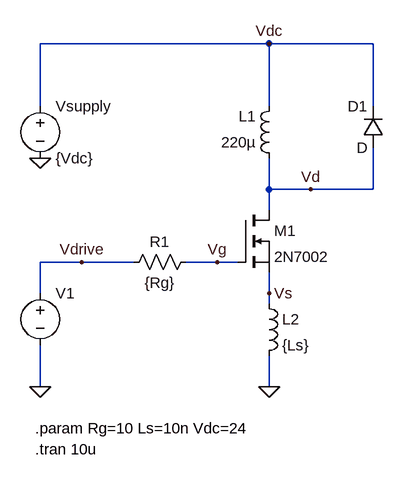
[diagram p0: schematic DoublePulseTest.asc]
DoublePulseTest.asc, the LTspice schematic file:
Version 4
SHEET 1 920 680
WIRE 432 -208 80 -208
WIRE 592 -208 432 -208
WIRE 80 -112 80 -208
WIRE 432 -112 432 -208
WIRE 592 -112 592 -208
WIRE 432 16 432 -32
WIRE 496 16 432 16
WIRE 592 16 592 -48
WIRE 592 16 496 16
WIRE 432 48 432 16
WIRE 144 128 80 128
WIRE 224 128 144 128
WIRE 352 128 304 128
WIRE 384 128 352 128
WIRE 80 176 80 128
WIRE 432 176 432 144
WIRE 432 192 432 176
WIRE 80 320 80 256
WIRE 432 320 432 272
FLAG 432 320 0
FLAG 80 320 0
FLAG 80 -32 0
FLAG 432 -208 Vdc
FLAG 352 128 Vg
FLAG 496 16 Vd
FLAG 432 176 Vs
FLAG 144 128 Vdrive
SYMBOL voltage 80 160 R0
WINDOW 3 24 96 Invisible 2
WINDOW 123 0 0 Left 0
WINDOW 39 0 0 Left 0
SYMATTR Value PWL(0 0 1u 0 1.001u 5 5.6u 5 5.6001u 0 7u 0 7.001u 5 8u 5 8.001u 0)
SYMATTR InstName V1
SYMBOL nmos 384 48 R0
SYMATTR InstName M1
SYMATTR Value 2N7002
SYMBOL diode 608 -48 R180
WINDOW 0 24 64 Left 2
WINDOW 3 24 0 Left 2
SYMATTR InstName D1
SYMBOL ind 448 -16 R180
WINDOW 0 36 80 Left 2
WINDOW 3 36 40 Left 2
SYMATTR InstName L1
SYMATTR Value 220µ
SYMBOL ind 416 176 R0
SYMATTR InstName L2
SYMATTR Value {Ls}
SYMBOL res 320 112 R90
WINDOW 0 0 56 VBottom 2
WINDOW 3 32 56 VTop 2
SYMATTR InstName R1
SYMATTR Value {Rg}
SYMBOL voltage 80 -128 R0
WINDOW 123 0 0 Left 0
WINDOW 39 0 0 Left 0
SYMATTR InstName Vsupply
SYMATTR Value {Vdc}
TEXT 72 384 Left 2 !.param Rg=10 Ls=10n Vdc=24
TEXT 72 416 Left 2 !.tran 10u

The netlist it stands for:
* DoublePulseTest.asc
V1 Vdrive 0 PWL(0 0 1u 0 1.001u 5 5.6u 5 5.6001u 0 7u 0 7.001u 5 8u 5 8.001u 0)
M1 Vd Vg Vs Vs 2N7002
D1 Vd Vdc D
L1 Vd Vdc 220µ
L2 Vs 0 {Ls}
R1 Vg Vdrive {Rg}
Vsupply Vdc 0 {Vdc}
.model D D
.lib standard.dio
.model NMOS NMOS
.model PMOS PMOS
.lib standard.mos
.param Rg=10 Ls=10n Vdc=24
.tran 10u
.backanno
.end